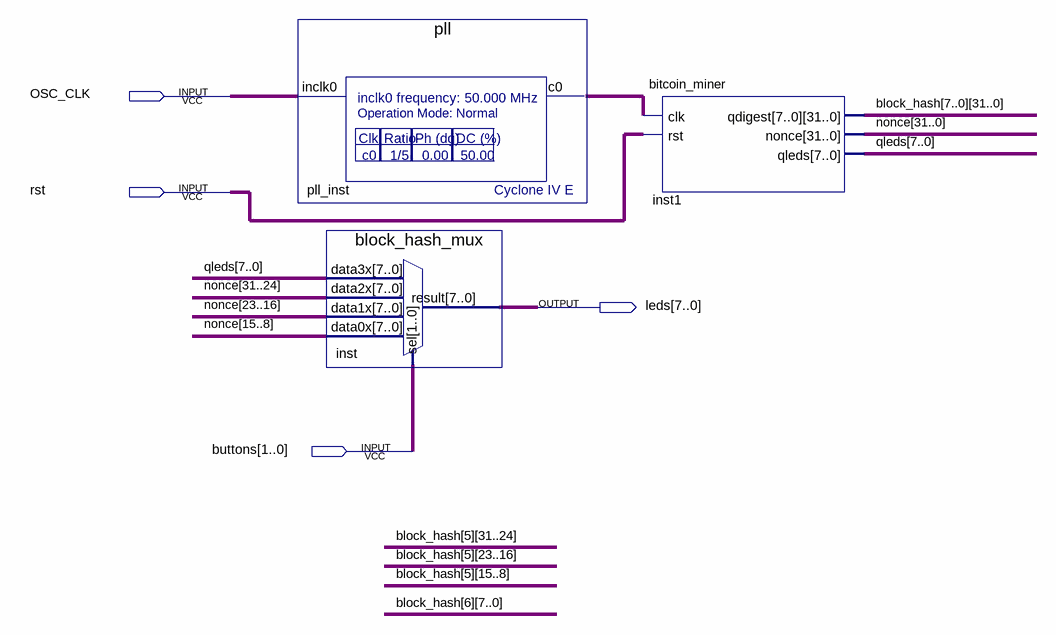
[diagram p0: schematic sheet]
// Quartus schematic fpga_miner.bdf as structural Verilog: 3 symbols, 4 pins
module fpga_miner (
  input  OSC_CLK,
  input  rst,
  input  [1:0] buttons,
  output [7:0] leds
);

  wire pll_inst_c0;
  wire [7:0] qleds;
  wire [31:0] block_hash_0, block_hash_1, block_hash_2, block_hash_3, block_hash_4, block_hash_5,
       block_hash_6, block_hash_7, nonce;

  pll pll_inst (.inclk0(OSC_CLK), .c0(pll_inst_c0));
  block_hash_mux inst (
    .data3x(qleds), .data2x(nonce[31:24]), .data1x(nonce[23:16]), .data0x(nonce[15:8]), .sel(buttons),
    .result(leds));
  bitcoin_miner inst1 (
    .clk(pll_inst_c0), .rst(rst),
    .qdigest({block_hash_7, block_hash_6, block_hash_5, block_hash_4, block_hash_3, block_hash_2, block_hash_1, block_hash_0}),
    .nonce(nonce), .qleds(qleds));
endmodule
